# Altium schematic sheet SlowDanceBot.SchDoc
size A3
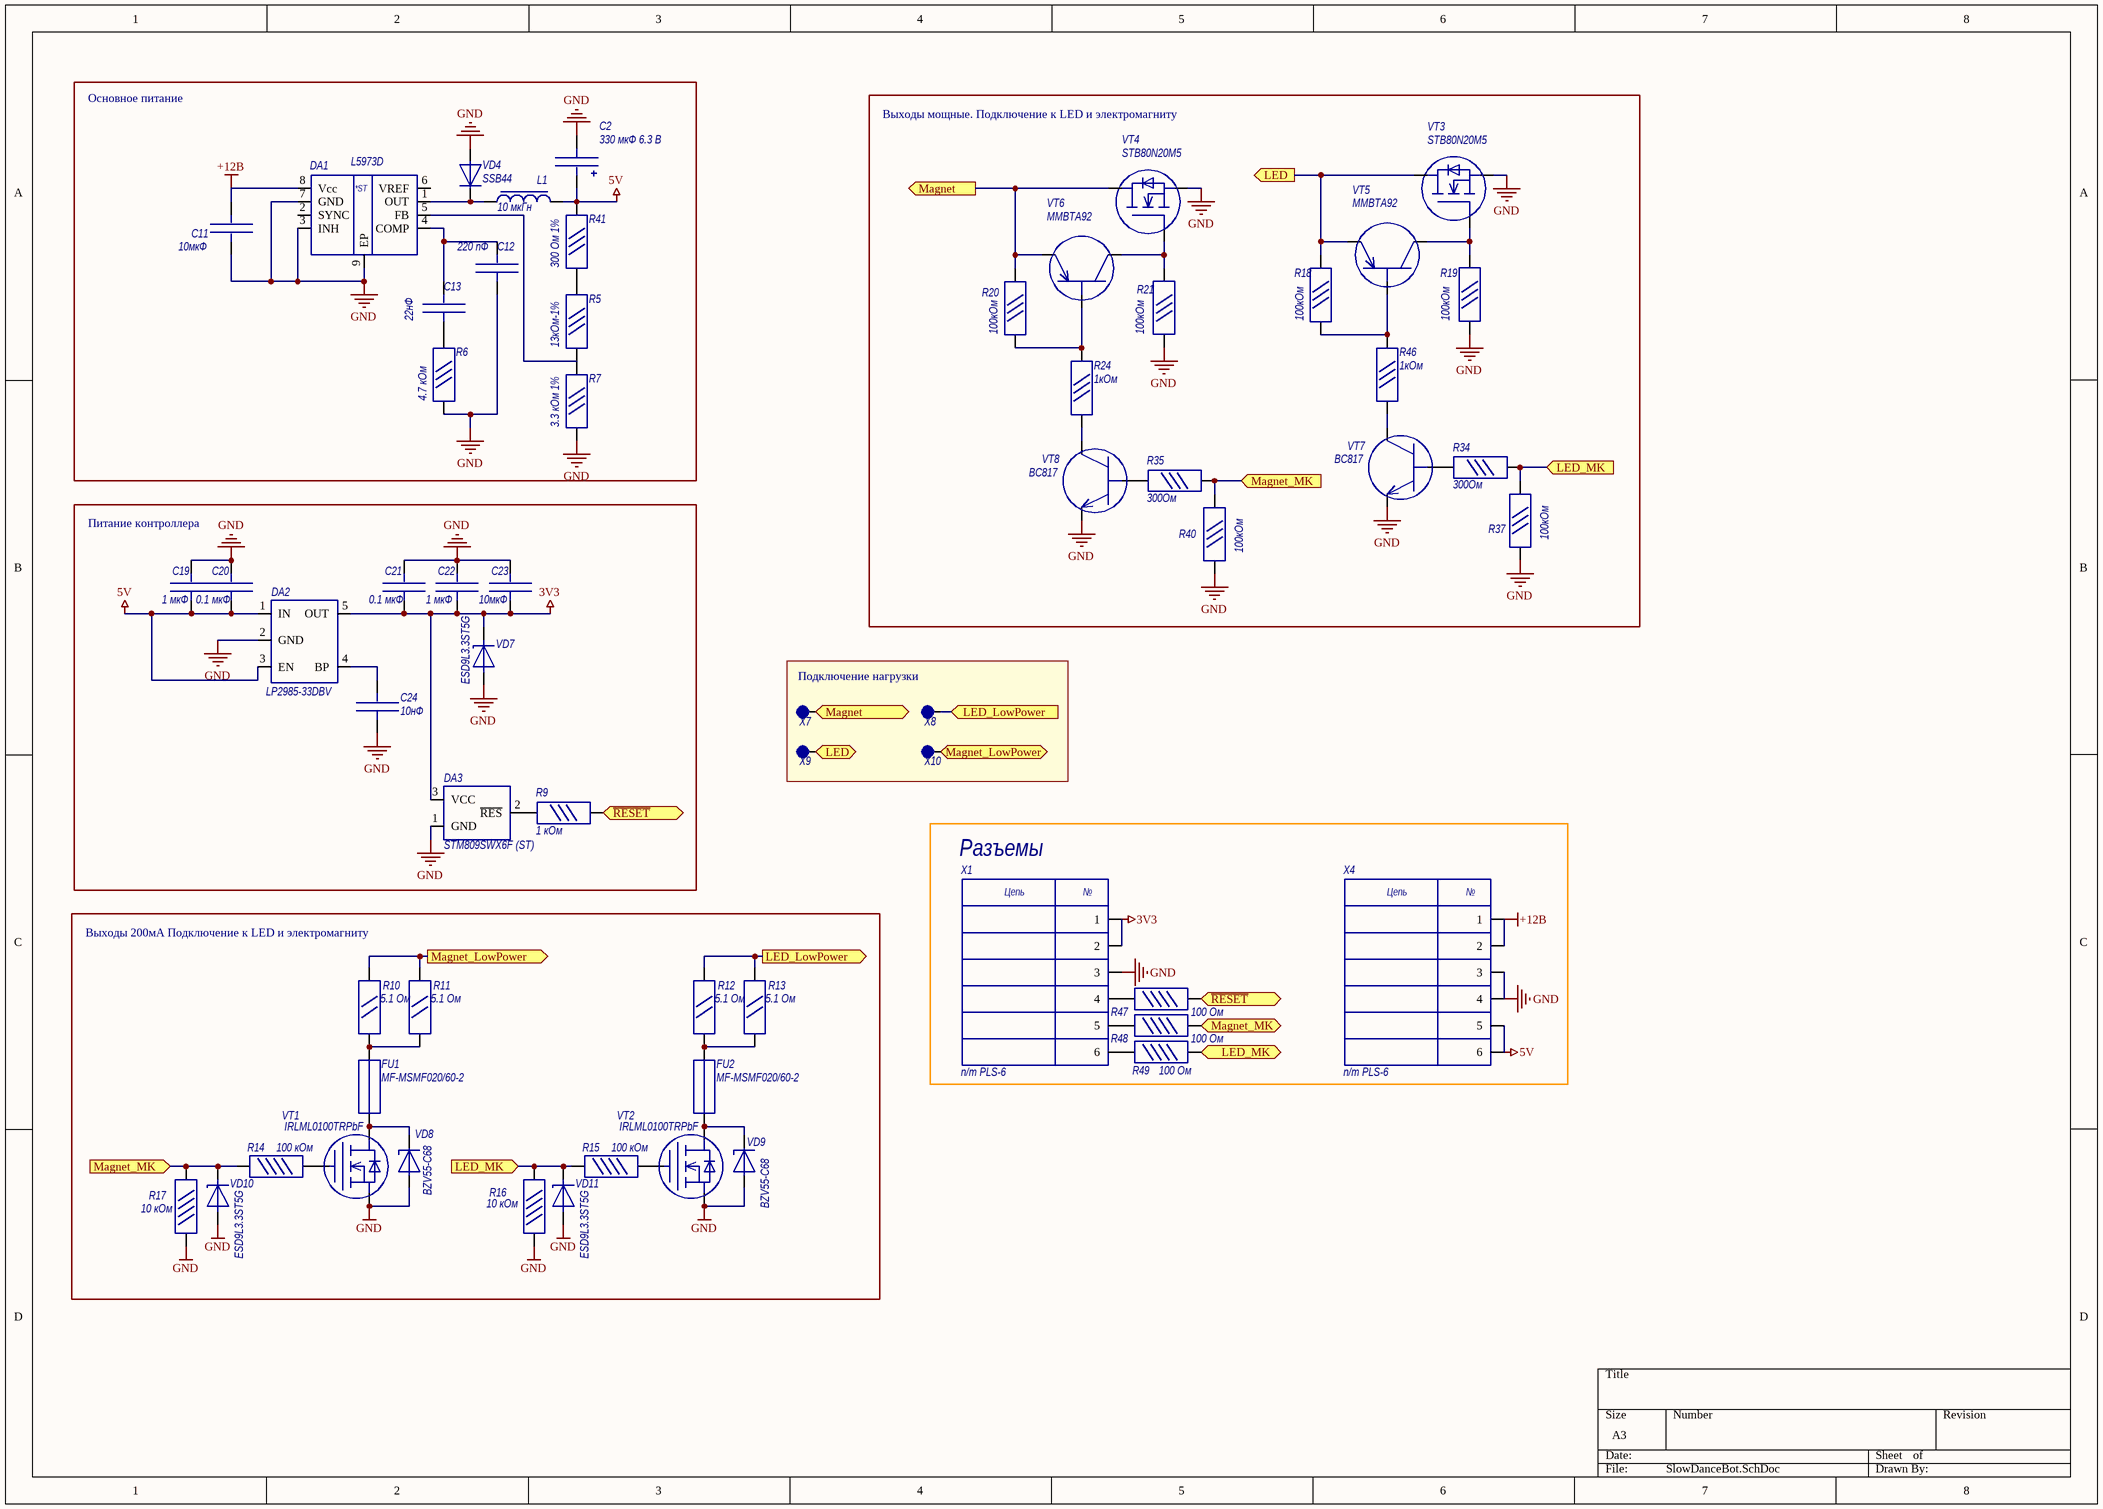
[diagram p0: SlowDanceBot.SchDoc]

## Parts
C2  value 330 мкФ 6.3 В  [CAP 6.3 x 5.8]  (hidden comment: WE 875105144010)
C11  value 10мкФ  [C0603_HD]  (hidden comment: C0603-X5R-16В-10мФ)
C12  value 220 пФ  [C0402_HD]  (hidden comment: C0402-X7R-16В-220pFФ-10%)
C13  value 22нФ  [C0402_HD]  (hidden comment: C0402-X7R-16В-22nF-10%)
C19  value 1 мкФ  [C0603_HD]  (hidden comment: C0603-X5R-16В-1мкФ)
C20  value 0.1 мкФ  [C0603_HD]  (hidden comment: C0603-X5R-16В-0.1мкФ)
C21  value 0.1 мкФ  [C0603_HD]  (hidden comment: C0603-X5R-16В-0.1мкФ)
C22  value 1 мкФ  [C0603_HD]  (hidden comment: C0603-X5R-16В-1мкФ)
C23  value 10мкФ  [C0603_HD]  (hidden comment: C0603-X5R-16В-10мФ)
C24  value 10нФ  [C0402_HD]  (hidden comment: C0402-X7R-16В-10nF-10%)
DA1  L5973D  [SOIC-8EP]
DA2  LP2985-33DBV  [SOT-23-5 (TI)]
DA3  STM809SWX6F (ST)  [SOT-23]
FU1  MF-MSMF020/60-2  [MF-MSMF020/60]
FU2  MF-MSMF020/60-2  [MF-MSMF020/60]
L1  value 10 мкГн  [WE 74437368xxxx]  (hidden comment: WE 74437368100)
R5  value 13кОм-1%  [R0603_HD]  (hidden comment: R0603-13кОм-1%)
R6  value 4.7 кОм  [R0603_HD]  (hidden comment: R0603-4.7кОм-5%)
R7  value 3.3 кОм 1%  [R0603_HD]  (hidden comment: R0603-3.3кОм-1%)
R9  value 1 кОм  [R0603_HD]  (hidden comment: R0603-1кОм-5%)
R10  value 5.1 Ом  [R0805_HD]  (hidden comment: R0805-5.1Ом-5%)
R11  value 5.1 Ом  [R0805_HD]  (hidden comment: R0805-5.1Ом-5%)
R12  value 5.1 Ом  [R0805_HD]  (hidden comment: R0805-5.1Ом-5%)
R13  value 5.1 Ом  [R0805_HD]  (hidden comment: R0805-5.1Ом-5%)
R14  value 100 кОм  [R0402_HD]  (hidden comment: R0402-100кОм-5%)
R15  value 100 кОм  [R0402_HD]  (hidden comment: R0402-100кОм-5%)
R16  value 10 кОм  [R0402_HD]  (hidden comment: R0402-10кОм-5%)
R17  value 10 кОм  [R0402_HD]  (hidden comment: R0402-10кОм-5%)
R18  value 100кОм  [R0603_HD]  (hidden comment: R0603-100кОм-5%)
R19  value 100кОм  [R0603_HD]  (hidden comment: R0603-100кОм-5%)
R20  value 100кОм  [R0603_HD]  (hidden comment: R0603-100кОм-5%)
R21  value 100кОм  [R0603_HD]  (hidden comment: R0603-100кОм-5%)
R24  value 1кОм  [R0603_HD]  (hidden comment: R0603-1кОм-5%)
R34  value 300Ом  [R0603_HD]  (hidden comment: R0603-300Ом-5%)
R35  value 300Ом  [R0603_HD]  (hidden comment: R0603-300Ом-5%)
R37  value 100кОм  [R0603_HD]  (hidden comment: R0603-100кОм-5%)
R40  value 100кОм  [R0603_HD]  (hidden comment: R0603-100кОм-5%)
R41  value 300 Ом 1%  [R0603_HD]  (hidden comment: R0603-300Ом-1%)
R46  value 1кОм  [R0603_HD]  (hidden comment: R0603-1кОм-5%)
R47  value 100 Ом  [R0402_min]  (hidden comment: R0402-100Ом-5%)
R48  value 100 Ом  [R0402_min]  (hidden comment: R0402-100Ом-5%)
R49  value 100 Ом  [R0402_min]  (hidden comment: R0402-100Ом-5%)
VD4  SSB44  [DO214AA(SMB)_POL]
VD7  ESD9L3.3ST5G  [SOD-923 (ON)]
VD8  BZV55-C68  [sod80c]
VD9  BZV55-C68  [sod80c]
VD10  ESD9L3.3ST5G  [SOD-923 (ON)]
VD11  ESD9L3.3ST5G  [SOD-923 (ON)]
VT1  IRLML0100TRPbF  [SOT-23]
VT2  IRLML0100TRPbF  [SOT-23]
VT3  STB80N20M5  [D2PAK-2 (ST)]
VT4  STB80N20M5  [D2PAK-2 (ST)]
VT5  MMBTA92  [SOT-23]
VT6  MMBTA92  [SOT-23]
VT7  BC817  [SOT-23]
VT8  BC817  [SOT-23]
X1  n/m PLS-6  [PLS-06]
X4  n/m PLS-6  [PLS-06]
X7  n/m  [Connection_pad]  (value not drawn)
X8  n/m  [Connection_pad]  (value not drawn)
X9  n/m  [Connection_pad]  (value not drawn)
X10  n/m  [Connection_pad]  (value not drawn)

## Blocks framed on the sheet
Основное питание: C2 C11-C13 DA1 L1 R5-R7 R41 VD4
Выходы мощные. Подключение к LED и электромагниту: R18-R21 R24 R34 R35 R37 R40 R46 VT3-VT8
Питание контроллера: C19-C24 DA2 DA3 R9 VD7
Подключение нагрузки: X7-X10
Разъемы: R47-R49 X1 X4
Выходы 200мА Подключение к LED и электромагниту: FU1 FU2 R10-R17 VD8-VD11 VT1 VT2

## Ports
LED (in), LED (out), LED_LowPower (in), LED_LowPower (out), LED_MK (in), Magnet (in), Magnet (out), Magnet_LowPower (in), Magnet_LowPower (out), Magnet_MK (in), ~{RESET} (out)

## Nets
3V3: C21.2 C22.2 C23.2 DA2.5(OUT) DA3.3(VCC) VD7.1(C) X1.1 X1.2
5V: C2.1(+) C19.2 C20.2 DA2.1(IN) DA2.3(EN) L1.2 R41.2 X4.5 X4.6
+12В: C11.1 DA1.8(Vcc) X4.1 X4.2
GND: C2.2(-) C11.2 C12.2 C19.1 C20.1 C21.1 C22.1 C23.1 C24.1 DA1.3(INH) DA1.7(GND) DA1.9(EP) DA2.2(GND) DA3.1(GND) R6.1 R7.1 R16.1 R17.1 R19.2 R21.2 R37.1 R40.1 VD4.1(A) VD7.2(A) VD8.1(A) VD9.1(A) VD10.2(A) VD11.2(A) VT1.2(S) VT2.2(S) VT3.3(S) VT4.3(S) VT7.2(E) VT8.2(E) X1.3 X4.3 X4.4
~{RESET}: R9.1 R47.2 ; port ~{RESET}
LED: R18.2 VT3.2(D) VT5.2(E) X9.1(CP) ; port LED
LED_LowPower: R12.2 R13.2 X8.1(CP) ; port LED_LowPower
LED_MK: R15.1 R16.2 R34.1 R37.2 R49.2 VD11.1(C) ; port LED_MK
Magnet: R20.2 VT4.2(D) VT6.2(E) X7.1(CP) ; port Magnet
Magnet_LowPower: R10.2 R11.2 X10.1(CP) ; port Magnet_LowPower
Magnet_MK: R14.1 R17.2 R35.1 R40.2 R48.2 VD10.1(C) ; port Magnet_MK
NetC12_1: C12.1 C13.1 DA1.4(COMP)
NetC13_2: C13.2 R6.2
NetC24_2: C24.2 DA2.4(BP)
NetDA1_1: DA1.1(OUT) L1.1 VD4.2(C)
NetDA1_5: DA1.5(FB) R5.1 R7.2
NetDA3_2: DA3.2(~{RES}) R9.2
NetFU1_1: FU1.1 VD8.2(C) VT1.3(D)
NetFU1_2: FU1.2 R10.1 R11.1
NetFU2_1: FU2.1 VD9.2(C) VT2.3(D)
NetFU2_2: FU2.2 R12.1 R13.1
NetR5_2: R5.2 R41.1
NetR14_2: R14.2 VT1.1(G)
NetR15_2: R15.2 VT2.1(G)
NetR18_1: R18.1 R46.2 VT5.1(B)
NetR19_1: R19.1 VT3.1(G) VT5.3(C)
NetR20_1: R20.1 R24.2 VT6.1(B)
NetR21_1: R21.1 VT4.1(G) VT6.3(C)
NetR24_1: R24.1 VT8.3(C)
NetR34_2: R34.2 VT7.1(B)
NetR35_2: R35.2 VT8.1(B)
NetR46_1: R46.1 VT7.3(C)
NetR47_1: R47.1 X1.4
NetR48_1: R48.1 X1.5
NetR49_1: R49.1 X1.6

Not connected (* = marked no-connect by the designer): DA1 2(SYNC) 6(VREF)

## Notes on the sheet
- (in symbol L5973D) *ST
- (in symbol PLS-6) Цепь; №

## Library data of the parts
C2 = CAP 875105144010
C11 C19-C23 = C0603_HD
C12 C13 C24 = C0402
DA2 = LP2985-xxDBV
DA3 = LM809M3-2.93
FU1 FU2 = MF-MSMF
L1 = WE 74437368xxxx
R5-R7 R9 R18-R21 R24 R34 R35 R37 R40 R41 R46 = R0603
R10-R13 = R0805
R14-R17 R47-R49 = R0402
VD8 VD9 = BZV55
VD10 VD11 = ESD9L5.0ST5G
VT1 VT2 = 2N7002
VT5 VT6 = MMBT5401
X1 X4 = PLS-6
X7-X10 = CONNECT PAD